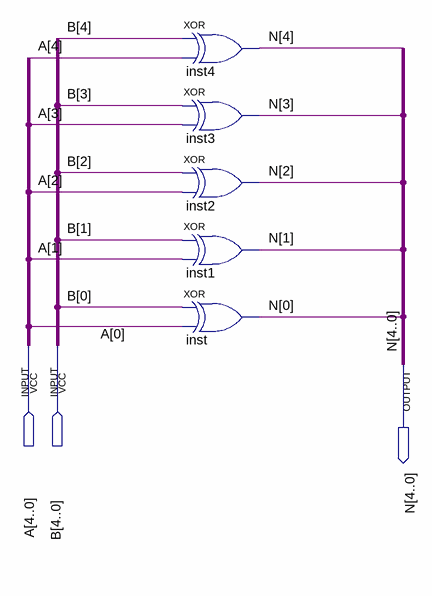
[diagram p0: schematic sheet]
// Quartus schematic xor_logic_operator.bdf as structural Verilog: 5 symbols, 3 pins
module xor_logic_operator (
  input  [4:0] A,
  input  [4:0] B,
  output [4:0] N
);

  xor inst4 (N[4], B[4], A[4]);
  xor inst3 (N[3], B[3], A[3]);
  xor inst2 (N[2], B[2], A[2]);
  xor inst1 (N[1], B[1], A[1]);
  xor inst (N[0], B[0], A[0]);
endmodule
